# Altium project BIOWOLF.PrjPcb
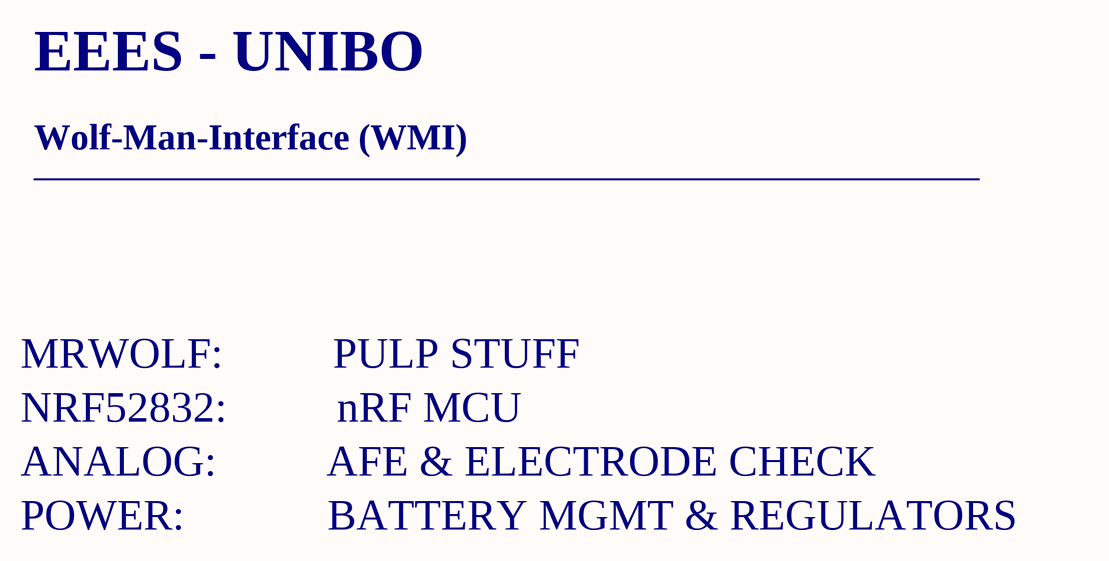
[diagram p0: 00_Cover.SchDoc]
4 sheets, 92 parts. Net scope: flat (ports and power ports of the same name join across sheets).
Board files: WOLFMAN.PcbDoc, Connectors.PcbDoc
Sheets:
  00_Cover.SchDoc
  01_MRWOLF.SchDoc
  02_NRF52832.SchDoc
  03_ANALOG.SchDoc

## Sheet 00_Cover.SchDoc
size A4

### Notes on the sheet
- EEES - UNIBO
- Wolf-Man-Interface (WMI)
- ___________________________________________
- MRWOLF:          PULP STUFF
- NRF52832:          nRF MCU
- ANALOG:          AFE & ELECTRODE CHECK
- POWER:             BATTERY MGMT & REGULATORS

## Sheet 01_MRWOLF.SchDoc: WMI (MR.WOLF)
size A4; Author: MARCO; DrawnBy: MARCO; ProjectName: WOLF-MAN-INTERFACE
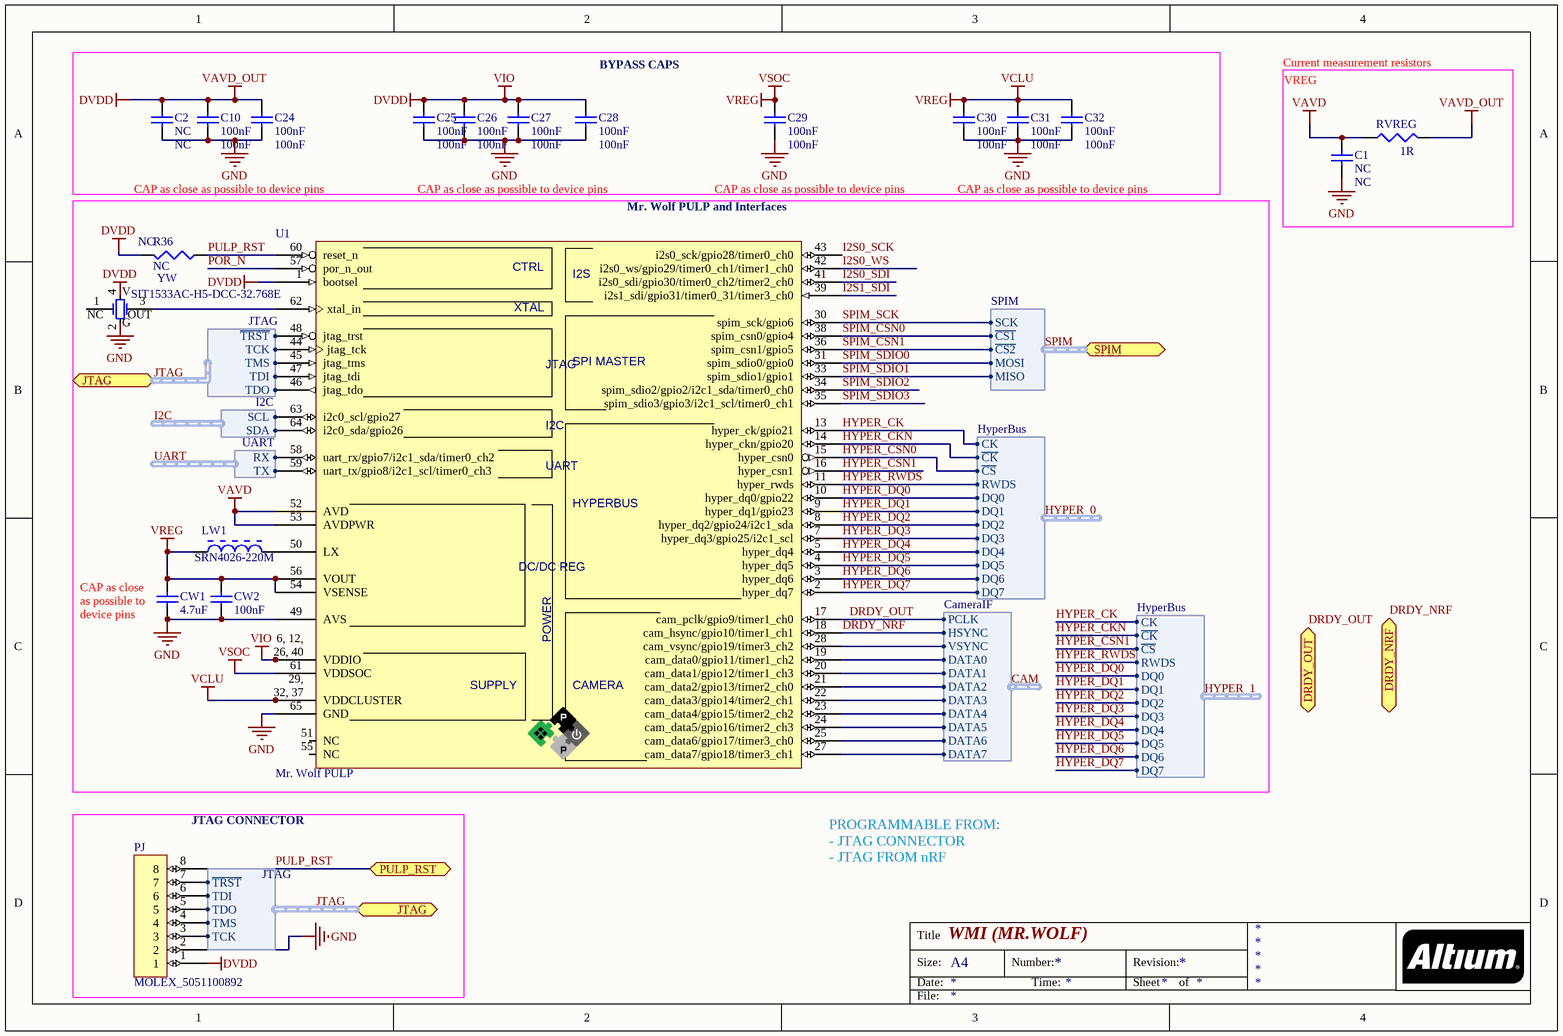
[diagram p1: 01_MRWOLF.SchDoc]

### Parts
C1  NC  [J1-0603]
C2  NC  [J1-0603]
C10  100nF  [0402]
C24  100nF  [0402]
C25  100nF  [0402]
C26  100nF  [0402]
C27  100nF  [0402]
C28  100nF  [0402]
C29  100nF  [0402]
C30  100nF  [0402]
C31  100nF  [0402]
C32  100nF  [0402]
CW1  4.7uF  [0402]
CW2  100nF  [0402]
LW1  SRN4026-220M  [1212_PCK]
PJ  MOLEX_5051100892  [MOLEX_5051100892]
R36  NC  [0402]
RVREG  value 1R  [J1-0603]
U1  Mr. Wolf PULP  [QFN50P900X900X100_HS_NOVIAS_65M]
YW  SIT1533AC-H5-DCC-32.768E  [SiT1533-C]

### Blocks framed on the sheet
BYPASS CAPS: C2 C10 C24-C32
Mr. Wolf PULP and Interfaces: CW1 CW2 LW1 R36 U1 YW
JTAG CONNECTOR: PJ

### Ports
DRDY_NRF (bidir), DRDY_OUT (bidir), JTAG (harness JTAG), PULP_RST (bidir), SPIM (harness SPIM)

### Harnesses
JTAG: ~{TRST}, TCK, TMS, TDI, TDO
HyperBus: CK, ~{CK}, ~{CS}, RWDS, DQ0, DQ1, DQ2, DQ3, DQ4, DQ5, DQ6, DQ7
I2C: SCL, SDA
UART: RX, TX
SPIM: SCK, ~{CS1}, ~{CS2}, MOSI, MISO
CameraIF: PCLK, HSYNC, VSYNC, DATA0, DATA1, DATA2, DATA3, DATA4, DATA5, DATA6, DATA7

### Nets
DVDD: C2.2 C10.2 C24.2 C25.2 C26.2 C27.2 C28.2 PJ.1 R36.2 RVREG.2 U1.1(bootsel) U1.6(VDDIO) U1.12(VDDIO) U1.26(VDDIO) U1.40(VDDIO) YW.4(VDD)  [also labelled VAVD_OUT, VIO]
GND: C1.1 C2.1 C10.1 C24.1 C25.1 C26.1 C27.1 C28.1 C29.1 C30.1 C31.1 C32.1 CW1.1 CW2.1 PJ.2 U1.49(AVS) U1.65(GND) YW.2(GND)  [project net DGND]
VAVD: C1.2 RVREG.1 U1.52(AVD) U1.53(AVDPWR)
VCLU: C29.2 C30.2 C31.2 C32.2 CW1.2 CW2.2 LW1.1 U1.29(VDDCLUSTER) U1.32(VDDCLUSTER) U1.37(VDDCLUSTER) U1.54(VSENSE) U1.56(VOUT) U1.61(VDDSOC)  [also labelled VREG, VSOC]
CAM.DATA0: U1.19(cam_data0/gpio11/timer1_ch2) ; harness CameraIF.DATA0
CAM.DATA1: U1.20(cam_data1/gpio12/timer1_ch3) ; harness CameraIF.DATA1
CAM.DATA2: U1.21(cam_data2/gpio13/timer2_ch0) ; harness CameraIF.DATA2
CAM.DATA3: U1.22(cam_data3/gpio14/timer2_ch1) ; harness CameraIF.DATA3
CAM.DATA4: U1.23(cam_data4/gpio15/timer2_ch2) ; harness CameraIF.DATA4
CAM.DATA5: U1.24(cam_data5/gpio16/timer2_ch3) ; harness CameraIF.DATA5
CAM.DATA6: U1.25(cam_data6/gpio17/timer3_ch0) ; harness CameraIF.DATA6
CAM.DATA7: U1.27(cam_data7/gpio18/timer3_ch1) ; harness CameraIF.DATA7
CAM.VSYNC: U1.28(cam_vsync/gpio19/timer3_ch2) ; harness CameraIF.VSYNC
DRDY_NRF: U1.18(cam_hsync/gpio10/timer1_ch1) ; port DRDY_NRF, harness CameraIF.HSYNC  [project net CAM.HSYNC]
DRDY_OUT: U1.17(cam_pclk/gpio9/timer1_ch0) ; port DRDY_OUT, harness CameraIF.PCLK  [project net CAM.PCLK]
HYPER_CK: U1.13(hyper_ck/gpio21) ; harness HyperBus.CK  [project net HYPER_0.CK]
HYPER_CKN: U1.14(hyper_ckn/gpio20) ; harness HyperBus.~{CK}  [project net HYPER_0.~{CK}]
HYPER_CSN0: U1.15(hyper_csn0) ; harness HyperBus.~{CS}  [project net HYPER_0.~{CS}]
HYPER_CSN1: U1.16(hyper_csn1) ; harness HyperBus.~{CS}  [project net HYPER_1.~{CS}]
HYPER_DQ0: U1.10(hyper_dq0/gpio22) ; harness HyperBus.DQ0  [project net HYPER_0.DQ0]
HYPER_DQ1: U1.9(hyper_dq1/gpio23) ; harness HyperBus.DQ1  [project net HYPER_0.DQ1]
HYPER_DQ2: U1.8(hyper_dq2/gpio24/i2c1_sda) ; harness HyperBus.DQ2  [project net HYPER_0.DQ2]
HYPER_DQ3: U1.7(hyper_dq3/gpio25/i2c1_scl) ; harness HyperBus.DQ3  [project net HYPER_0.DQ3]
HYPER_DQ4: U1.5(hyper_dq4) ; harness HyperBus.DQ4  [project net HYPER_0.DQ4]
HYPER_DQ5: U1.4(hyper_dq5) ; harness HyperBus.DQ5  [project net HYPER_0.DQ5]
HYPER_DQ6: U1.3(hyper_dq6) ; harness HyperBus.DQ6  [project net HYPER_0.DQ6]
HYPER_DQ7: U1.2(hyper_dq7) ; harness HyperBus.DQ7  [project net HYPER_0.DQ7]
HYPER_RWDS: U1.11(hyper_rwds) ; harness HyperBus.RWDS  [project net HYPER_0.RWDS]
I2C.SCL: U1.63(i2c0_scl/gpio27) ; harness I2C.SCL
I2C.SDA: U1.64(i2c0_sda/gpio26) ; harness I2C.SDA
I2S0_SCK: U1.43(i2s0_sck/gpio28/timer0_ch0)
I2S0_SDI: U1.41(i2s0_sdi/gpio30/timer0_ch2/timer2_ch0)
I2S0_WS: U1.42(i2s0_ws/gpio29/timer0_ch1/timer1_ch0)
I2S1_SDI: U1.39(i2s1_sdi/gpio31/timer0_31/timer3_ch0)
JTAG.~{TRST}: PJ.7 U1.48(jtag_trst) ; port JTAG.~{TRST}
JTAG.TCK: PJ.3 U1.44(jtag_tck) ; port JTAG.TCK
JTAG.TDI: PJ.6 U1.47(jtag_tdi) ; port JTAG.TDI
JTAG.TDO: PJ.5 U1.46(jtag_tdo) ; port JTAG.TDO
JTAG.TMS: PJ.4 U1.45(jtag_tms) ; port JTAG.TMS
POR_N: U1.57(por_n_out)
PULP_RST: PJ.8 R36.1 U1.60(reset_n) ; port PULP_RST  [project net P0.29/AIN5]
SPIM_CSN0: U1.38(spim_csn0/gpio4) ; port SPIM.~{CS1}  [project net CS#]
SPIM_CSN1: U1.36(spim_csn1/gpio5) ; port SPIM.~{CS2}  [project net CS_nRF#]
SPIM_SCK: U1.30(spim_sck/gpio6) ; port SPIM.SCK  [project net SCK]
SPIM_SDIO0: U1.31(spim_sdio0/gpio0) ; port SPIM.MOSI  [project net MOSI]
SPIM_SDIO1: U1.33(spim_sdio1/gpio1) ; port SPIM.MISO  [project net MISO]
SPIM_SDIO2: U1.34(spim_sdio2/gpio2/i2c1_sda/timer0_ch0)
SPIM_SDIO3: U1.35(spim_sdio3/gpio3/i2c1_scl/timer0_ch1)
UART.RX: U1.58(uart_rx/gpio7/i2c1_sda/timer0_ch2) ; harness UART.RX
UART.TX: U1.59(uart_tx/gpio8/i2c1_scl/timer0_ch3) ; harness UART.TX
NetLW1_2: LW1.2 U1.50(LX)
NetU1_62: U1.62(xtal_in) YW.3(OUT)

Not connected (* = marked no-connect by the designer): U1 51(NC) 55(NC); YW 1(NC)

### Buses and harness runs
harness JTAG = port JTAG
harness SPIM = port SPIM

### Notes on the sheet
- Current measurement resistors
- VREG
- CAP as close as possible to device pins
- (near CW1) CAP as close as possible to device pins
- PROGRAMMABLE FROM:
  - JTAG CONNECTOR
  - JTAG FROM nRF
- Title
- Size:
- Date:
- A4
- Number:
- Time:
- Revision:
- Sheet
- of
- File:
- (in symbol PULP_MR_WOLF) CTRL; I2S; XTAL; JTAG; SPI MASTER; I2C; UART; HYPERBUS; DC/DC REG; POWER; 6, 12,; 26, 40; 29,; SUPPLY; CAMERA; 32, 37
- (in symbol SIT-OSC32KHZ-SIT1533AC-H5-DCC-32.768) V; G

### Library data of the parts
C1 C2 C10 C24-C32 = Cap Semi: Capacitor (Semiconductor SIM Model); Published: 8-Jun-2000; LatestRevisionDate: 29-May-2009; LatestRevisionNote: IPC-7351 Footprint Added.; PackageReference: C1206; Publisher: Altium Limited; PackageDescription: Chip Capacitor
  C1 C2: Value: NC
  C10 C24-C32: Value: 100nF
CW1 CW2 = Cap Semi: Capacitor (Semiconductor SIM Model); Value: 100pF; Published: 8-Jun-2000; LatestRevisionDate: 29-May-2009; LatestRevisionNote: IPC-7351 Footprint Added.; PackageReference: C1206; Publisher: Altium Limited; PackageDescription: Chip Capacitor
LW1 = BOUR-IND-SRN4026-220M: Semi-shielded Power Inductor, 22uH, 3A; Manufacturer: Bourns; Core Material: Ferrite; Tolerance: 20%; Current Rating: 670mA; DC Resistance (DCR): 234mR; Self Resonant Frequency: 16MHz; Test Frequency: 100kHz; ComponentLink1URL: https://www.bourns.com/docs/Product-Datasheets/SRN4026.pdf; ComponentLink1Description: Datasheet; Supplier 1: RSComponents; Supplier Part Number 1: 813-5643P; Manufacturer Part Number: SRN4026-220M; Stock 1: 2770; Pricing 1: 100=0.209, 500=0.176, 3000=0.135, 6000=0.132 (EUR); Mount: Surface Mount; Case/Package: Nonstandard; Weight: 0.004938oz; Min Operating Temperature: -40°C; Max Operating Temperature: 125°C; Packaging: Tape and Reel; Composition: Wirewound; Inductance: 22uh; Saturation Current: 670mA; Shielding: Shielded; Max DC Current: 670mA; Termination: SMD/SMT; RMS Current (Irms): 670mA; Inductance Tolerance: 20%; Package Quantity: 3000; Length: 4mm; Height: 2.5mm; Width: 4mm; Height - Seated (Max): 0.098inch; Depth: 4mm; REACH SVHC: No SVHC; ComponentLink2URL: https://datasheet.ciiva.com/48684/srn4026-48684665.pdf; ComponentLink2Description: https://datasheet.ciiva.com/48684/srn4026-48684665.pdf; ComponentLink3URL: https://datasheet.ciiva.com/46641/70371276-46641103.pdf; ComponentLink3Description: https://datasheet.ciiva.com/46641/70371276-46641103.pdf; Supplier 2: Farnell; Supplier Part Number 2: 2428221; Stock 2: 402; Pricing 2: 5=0.298, 50=0.217, 250=0.175, 500=0.16, 1500=0.155, 3000=0.151, 15000=0.146 (EUR); Supplier 3: Digi-Key; Supplier Part Number 3: SRN4026-220MTR-ND; Stock 3: 0; Pricing 3: 3000=0.144, 6000=0.1395, 15000=0.135, 30000=0.133 (USD); Supplier 4: Digi-Key; Supplier Part Number 4: SRN4026-220MDKR-ND; Stock 4: 863; Pricing 4: 1=0.41, 10=0.362, 100=0.2588, 500=0.2174, 1000=0.176 (USD); Supplier 5: Mouser; Supplier Part Number 5: 652-SRN4026-220M; Stock 5: 140; Pricing 5: 1=0.36, 10=0.246, 50=0.246, 100=0.224, 1000=0.152, 10000=0.122 (USD); Supplier 6: Digi-Key; Supplier Part Number 6: SRN4026-220MCT-ND; Stock 6: 863; Pricing 6: 1=0.41, 10=0.362, 100=0.2588, 500=0.2174, 1000=0.176 (USD); Supplier 7: RSComponents; Supplier Part Number 7: 8135643; Stock 7: 1990; Pricing 7: 10=0.227, 100=0.216, 500=0.19, 3000=0.13, 6000=0.12 (GBP); Supplier 8: Distrelec; Supplier Part Number 8: SRN4026-220M; Stock 8: 3000; Pricing 8: 1=0.6667, 10=0.5, 100=0.3333, 500=0.2857 (EUR); Supplier 9: Farnell; Supplier Part Number 9: 2428221RL; Stock 9: 930; Pricing 9: 50=0.209, 250=0.165, 500=0.15, 1500=0.122, 3000=0.117, 15000=0.106, 30000=0.104 (GBP); Supplier 10: Distrelec; Supplier Part Number 10: 30026188; Stock 10: 2895; Pricing 10: 1=0.214, 10=0.1299, 50=0.1266, 250=0.1203, 500=0.1173, 2500=0.1145 (EUR); Supplier 11: RSComponents; Supplier Part Number 11: 813-5643; Stock 11: 2000; Pricing 11: 10=0.227, 100=0.216 (GBP)
R36 RVREG = Res3: Resistor; Published: 8-Jun-2000; LatestRevisionDate: 29-May-2009; LatestRevisionNote: IPC-7351 Footprint Added.; PackageReference: J1-0603; Publisher: Altium Limited; PackageDescription: Chip Resistor
  R36: Value: NC
U1 = PULP_MR_WOLF: Mr. Wolf PULP Heterogeneous Multi-Core System-On-Chip; Manufacturer: Aries Alectronics Inc.; Manufacturer Part Num: 23017; Part Class: Connectors; .checked_Footprint: 140604-11/scd; Num Pins: 64 (+9)
YW = SIT-OSC32KHZ-SIT1533AC-H5-DCC-32.768: 20 ppm, Ultra-Low Power 32.768 kHz Quartz XTAL Replacement; Current - Supply (max): 1.3uA; ComponentLink1URL: http://www.sitime.com/products/datasheets/sit1533/SiT1533-datasheet.pdf; ComponentLink1Description: Datasheet; Frequency: 32.768kHz; Supplier 1: Digi-Key; Supplier Part Number 1: 1473-1515-2-ND; Supplier 2: Digi-Key; Supplier Part Number 2: 1473-1515-1-ND; Supplier 3: Digi-Key; Supplier Part Number 3: 1473-1515-6-ND; Supplier 4: Digi-Key; Supplier Part Number 4: 1473-1516-2-ND; Supplier 5: Digi-Key; Supplier Part Number 5: 1473-1516-1-ND; Supplier 6: Digi-Key; Supplier Part Number 6: 1473-1516-6-ND; Supplier 7: Digi-Key; Supplier Part Number 7: SIT1533AC-H5-DCC-32.768S-ND; Supplier 8: Digi-Key; Supplier Part Number 8: SIT1533AC-H5-DCC-32.768D-ND

## Sheet 02_NRF52832.SchDoc: WMI (BLE)
size A4
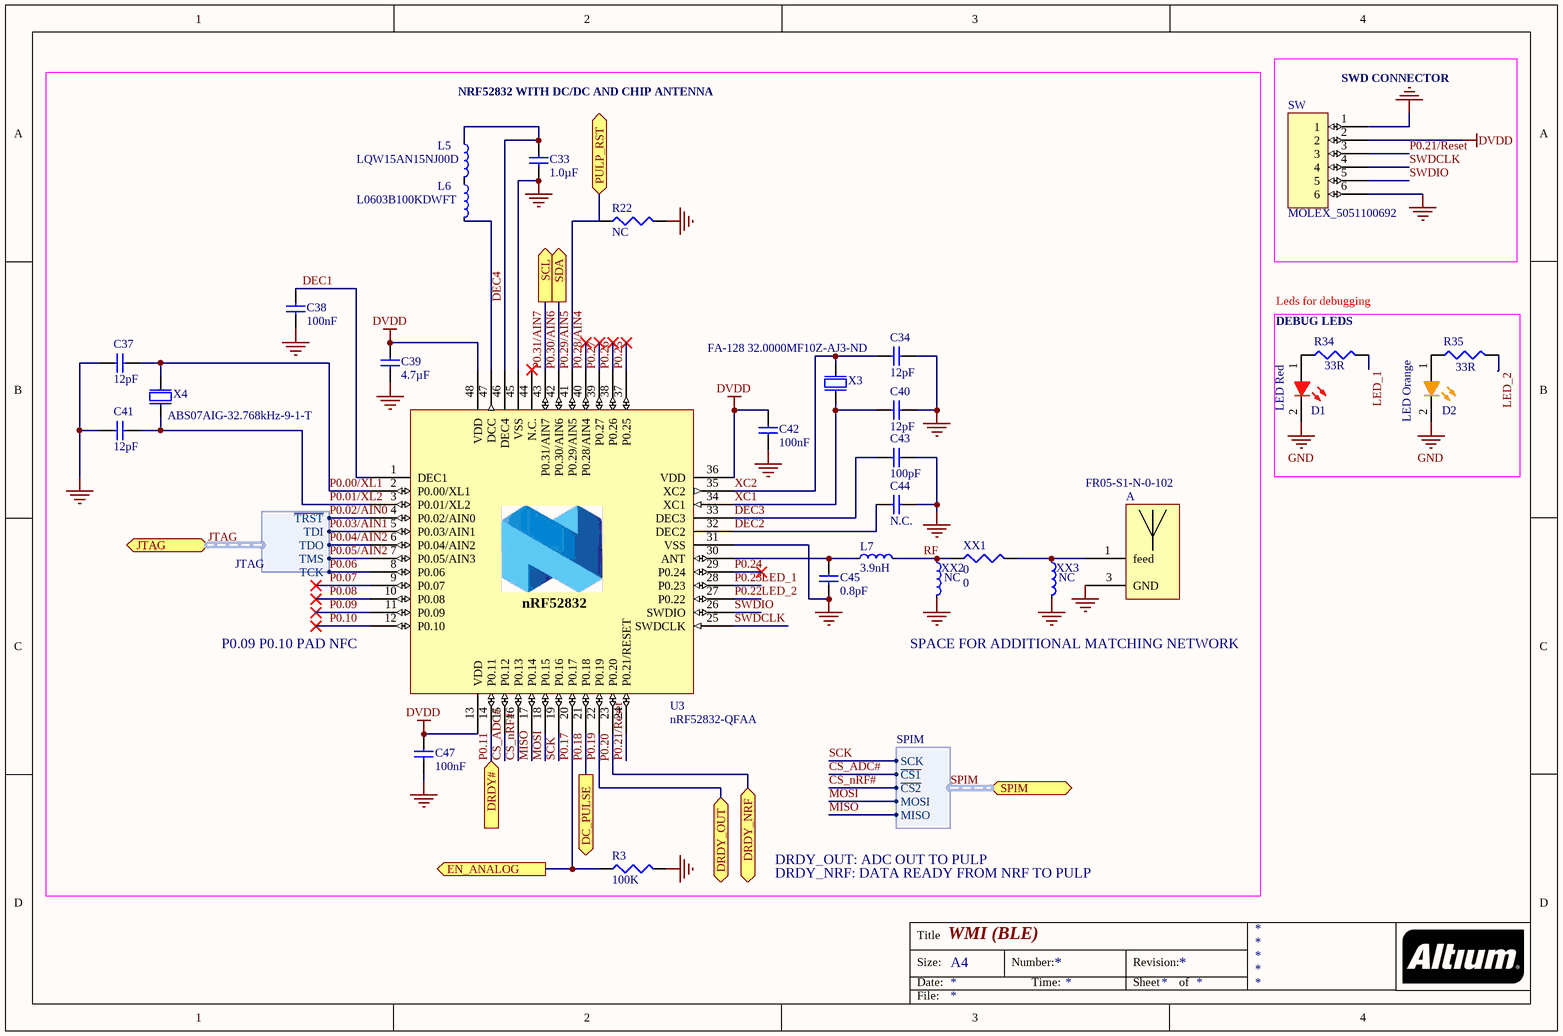
[diagram p2: 02_NRF52832.SchDoc]

### Parts
A  FR05-S1-N-0-102  [DFN510P700X220-2N]
C33  1.0µF  [CAPC1608X06L]
C34  12pF  [CAPC1005X04L]
C37  12pF  [CAPC1005X04L]
C38  100nF  [CAPC1005X04L]
C39  4.7µF  [CAPC1608X06L]
C40  12pF  [CAPC1005X04L]
C41  12pF  [CAPC1005X04L]
C42  100nF  [CAPC1005X04L]
C43  100pF  [CAPC1005X04L]
C44  N.C.  [CAPC1005X04L]
C45  0.8pF  [CAPC1005X04L]
C47  100nF  [CAPC1005X04L]
D1  LED Red  [DIOC1608X08L]
D2  LED Orange  [DIOC1608X08L]
L5  LQW15AN15NJ00D  [INDC1005X04L]
L6  L0603B100KDWFT  [J1-0603]
L7  3.9nH  [INDC1005X04L]
R3  100K  [0402]
R22  NC  [0402]  (graphical)
R34  value 33R  [J1-0603]
R35  value 33R  [J1-0603]
SW  MOLEX_5051100692  [MOLEX_5051100692]
U3  nRF52832-QFAA  [QFN40P600X600X90-48N]
X3  FA-128 32.0000MF10Z-AJ3-ND  [BT-XTAL_2016]
X4  ABS07AIG-32.768kHz-9-1-T  [XTAL_3215]
XX1  0  [0402]
XX2  NC  [INDC1005X04L]
XX3  NC  [INDC1005X04L]

### Blocks framed on the sheet
SWD CONNECTOR: SW
DEBUG LEDS: D1 D2 R34 R35

### Ports
DC_PULSE (out), DRDY# (in), DRDY_NRF (bidir), DRDY_OUT (bidir), EN_ANALOG (out), JTAG (harness JTAG), PULP_RST (bidir), SCL (out), SDA (out), SPIM (harness SPIM)

### Harnesses
SPIM: SCK, ~{CS1}, ~{CS2}, MOSI, MISO
JTAG: ~{TRST}, TCK, TMS, TDI, TDO

### Nets
DVDD: C39.1 C42.1 C47.1 SW.2 U3.13(VDD) U3.36(VDD) U3.48(VDD)
GND: A.3(GND) C33.1 C34.2 C37.2 C38.2 C39.2 C40.2 C41.2 C42.2 C43.2 C44.1 C45.1 C47.2 D1.2(K) D2.2(K) R3.2 R22.2 SW.1 SW.6 U3.31(VSS) U3.45(VSS) U3.49(GND) X3.2(GND) X3.4(GND) XX2.2 XX3.2  [project net DGND]
CS_ADC#: U3.15(P0.12) ; port SPIM.~{CS1}  [project net CS#]
CS_nRF#: U3.16(P0.13) ; port SPIM.~{CS2}
DEC1: C38.1 U3.1(DEC1)
DEC2: C44.2 U3.32(DEC2)
DEC3: C43.1 U3.33(DEC3)
DEC4: C33.2 L5.1 U3.46(DEC4)
LED_1: R34.2 U3.28(P0.23)  [also labelled P0.23]
LED_2: R35.2 U3.27(P0.22)  [also labelled P0.22]
MISO: U3.17(P0.14) ; port SPIM.MISO
MOSI: U3.18(P0.15) ; port SPIM.MOSI
P0.00/XL1: C37.1 U3.2(P0.00/XL1) X4.1(inp)
P0.01/XL2: C41.1 U3.3(P0.01/XL2) X4.2(out)
P0.02/AIN0: U3.4(P0.02/AIN0) ; port JTAG.~{TRST}  [project net JTAG.~{TRST}]
P0.03/AIN1: U3.5(P0.03/AIN1) ; port JTAG.TDI  [project net JTAG.TDI]
P0.04/AIN2: U3.6(P0.04/AIN2) ; port JTAG.TDO  [project net JTAG.TDO]
P0.05/AIN2: U3.7(P0.05/AIN3) ; port JTAG.TMS  [project net JTAG.TMS]
P0.06: U3.8(P0.06) ; port JTAG.TCK  [project net JTAG.TCK]
P0.07: U3.9(P0.07)
P0.08: U3.10(P0.08)
P0.09: U3.11(P0.09)
P0.10: U3.12(P0.10)
P0.11: U3.14(P0.11) ; port DRDY#
P0.17: R3.1 U3.20(P0.17) ; port EN_ANALOG
P0.18: U3.21(P0.18) ; port DC_PULSE
P0.19: U3.22(P0.19) ; port DRDY_OUT  [project net CAM.PCLK]
P0.20: U3.23(P0.20) ; port DRDY_NRF  [project net CAM.HSYNC]
P0.21/Reset: SW.3 U3.24(P0.21/RESET)
P0.24: U3.29(P0.24)
P0.25: U3.37(P0.25)
P0.26: U3.38(P0.26)
P0.27: U3.39(P0.27)
P0.28/AIN4: U3.40(P0.28/AIN4)
P0.29/AIN5: R22.1 U3.41(P0.29/AIN5) ; port PULP_RST
P0.30/AIN6: U3.42(P0.30/AIN6) ; port SDA
P0.31/AIN7: U3.43(P0.31/AIN7) ; port SCL
RF: L7.2 XX1.1 XX2.1
SCK: U3.19(P0.16) ; port SPIM.SCK
SWDCLK: SW.4 U3.25(SWDCLK)
SWDIO: SW.5 U3.26(SWDIO)
XC1: C40.1 U3.34(XC1) X3.1(inp)
XC2: C34.1 U3.35(XC2) X3.3(out)
NetA_1: A.1(feed) XX1.2 XX3.1
NetC45_2: C45.2 L7.1 U3.30(ANT)
NetD1_1: D1.1(A) R34.1
NetD2_1: D2.1(A) R35.1
NetL5_2: L5.2 L6.1
NetL6_2: L6.2 U3.47(DCC)

Not connected (* = marked no-connect by the designer): A 2(not_connected); U3 44(N.C.)*

### Buses and harness runs
harness JTAG = port JTAG
harness SPIM = port SPIM

### Notes on the sheet
- NRF52832 WITH DC/DC AND CHIP ANTENNA
- Leds for debugging
- (near U3) P0.09 P0.10 PAD NFC
- SPACE FOR ADDITIONAL MATCHING NETWORK
- DRDY_OUT: ADC OUT TO PULP
- DRDY_NRF: DATA READY FROM NRF TO PULP
- Title
- Size:
- Date:
- A4
- Number:
- Time:
- Revision:
- Sheet
- of
- File:
- (in symbol nRF52832-QFAB) nRF52832

### Library data of the parts
A = FR05-S1-N-0-102: Bluetooth antenna
C33 = C0603-1µ0: Capacitor, X7R, ±10%; Note: 16V; Artikkelnr Noca: 20039335; Artikkelnr Simpro: N.A.; Part Number: C0603-1µ0; Manufacturer: *; Manufacturer Part Number: *; Datasheet: *; LatestRevisionDate: 2013-06-05; Pin Count: 2; Publisher: Nordic Semiconductor; Published: 2009-05-08; Value: 1.0µF; Supplier: *; Supplier part number: *; 2nd source Supplier: *; 2nd source part number: *; Footprint Doc: 0603
C34 C37 C40 C41 = C0402-12p: Capacitor, NP0, ±2%; Note: 50V; Artikkelnr Noca: 20029159; Artikkelnr Simpro: N.A.; Part Number: C0402-12p; Manufacturer: *; Manufacturer Part Number: *; Datasheet: *; LatestRevisionDate: 2011-05-11; Pin Count: 2; Publisher: Nordic Semiconductor; Published: 2009-05-08; Value: 12pF; Supplier: *; Supplier part number: *; 2nd source Supplier: *; 2nd source part number: *; Footprint Doc: 0402
C38 C42 C47 = C0402-100n: Capacitor, X7R, ±10%; Note: 16V; Artikkelnr Noca: 20039200; Artikkelnr Simpro: N.A.; Part Number: C0402-100n; Manufacturer: *; Manufacturer Part Number: *; Datasheet: *; LatestRevisionDate: 2009-11-23; Pin Count: 2; Publisher: Nordic Semiconductor; Published: 2009-05-08; Value: 100nF; Supplier: *; Supplier part number: *; 2nd source Supplier: *; 2nd source part number: *; Footprint Doc: 0402
C39 = C0603-4µ7: Capacitor, X5R, ±10%; Note: 6.3V; Artikkelnr Noca: 20069060; Artikkelnr Simpro: N.A.; Part Number: C0603-4µ7; Manufacturer: *; Manufacturer Part Number: *; Datasheet: *; LatestRevisionDate: 2009-11-23; Pin Count: 2; Publisher: Nordic Semiconductor; Published: 2009-05-08; Value: 4.7µF; Supplier: *; Supplier part number: *; 2nd source Supplier: *; 2nd source part number: *; Footprint Doc: 0603
C43 = C0402-100p: Capacitor, NP0, ±5%; Note: 50V; Artikkelnr Noca: 20029135; Artikkelnr Simpro: N.A.; Part Number: C0402-100p; Manufacturer: *; Manufacturer Part Number: *; Datasheet: *; LatestRevisionDate: 2009-05-08; Pin Count: 2; Publisher: Nordic Semiconductor; Published: 2009-05-08; Value: 100pF; Supplier: *; Supplier part number: *; 2nd source Supplier: *; 2nd source part number: *; Footprint Doc: 0402
C44 = C0402-N.C.: Not mounted; Note: Chip Cap; Artikkelnr Noca: N.A.; Part Number: C0402-N.C.; Manufacturer: *; Manufacturer Part Number: *; Datasheet: *; LatestRevisionDate: 2009-05-08; Pin Count: 2; Publisher: Nordic Semiconductor; Published: 2009-05-08; Value: N.C.; Supplier: *; Supplier part number: *; 2nd source Supplier: *; 2nd source part number: *; Footprint Doc: 0402; Artikkelnr Simpro: N.A.
C45 = C0402-0.8p: Capacitor, NP0, ±5%; Note: 50V; Artikkelnr Noca: 20029147; Artikkelnr Simpro: N.A.; Part Number: C0402-0.8p; Manufacturer: *; Manufacturer Part Number: *; Datasheet: *; LatestRevisionDate: 2012-11-21; Pin Count: 2; Publisher: Nordic Semiconductor; Published: 2009-05-08; Value: 0.8pF; Supplier: *; Supplier part number: *; 2nd source Supplier: *; 2nd source part number: *; Footprint Doc: 0402
D1 = KING-LED-RED-APT1608LSECK/J3-PRV: 1.6X0.8mm SMD CHIP LED LAMP, Hyper Red; Part Number: APT1608LSECK/J4-PRV; Forward Voltage: 1.8V; Test Current: 2mA; ComponentLink1Description: Datasheet; ComponentLink1URL: http://www.kingbrightusa.com/images/catalog/SPEC/APT1608LSECK-J3-PRV.pdf; Supplier 1: Digi-Key; Supplier 2: Mouser; Supplier 3: Digi-Key; Supplier 4: Digi-Key; Supplier Part Number 1: 754-1930-6-ND; Supplier Part Number 2: 604-APT1608LSECKJ3RV; Supplier Part Number 3: 754-1930-1-ND; Supplier Part Number 4: 754-1930-2-ND
D2 = KING-LED-ORANGE-APT1608LSECK/J4-PRV: 1.6X0.8mm SMD CHIP LED LAMP, Super Bright Orange; Forward Voltage: 1.8V; Test Current: 2mA; Part Number: APT1608LSECK/J4-PRV; ComponentLink1Description: Datasheet; ComponentLink1URL: http://www.kingbrightusa.com/images/catalog/SPEC/APT1608LSECK-J4-PRV.pdf; Supplier 1: Digi-Key; Supplier 2: Digi-Key; Supplier 3: Mouser; Supplier 4: Digi-Key; Supplier Part Number 1: 754-1931-6-ND; Supplier Part Number 2: 754-1931-1-ND; Supplier Part Number 3: 604-APT1608LSECKJ4RV; Supplier Part Number 4: 754-1931-2-ND
L5 = L0402-15n: High frequency chip inductor ±10%; Manufacturer: Taiyo Yuden; Manufacturer Part Number: HK100515NJ-T; 2nd source part number: 658-1328; Value: 15nH; Artikkelnr Noca: 33029323; Artikkelnr Simpro: N.A.; Part Number: L0402-15n; LatestRevisionDate: 2012-09-19; Pin Count: 2; Publisher: Nordic Semiconductor; Published: 2010-07-12; Note: High frequency chip inductor ±10%; Supplier: Digi-Key; Datasheet: http://www.yuden.co.jp/productdata/catalog/en/mlci04_e.pdf; Supplier part number: 587-1521-1-ND; 2nd source Supplier: Farnell; Footprint Doc: 0402
L6 = L0603-10µ: Chip inductor, IDC,min = 50 mA, ±20%; Manufacturer: Taiyo Yuden; Manufacturer Part Number: LBMF1608T100K; 2nd source part number: 178-6105; Value: 10µH; Note: LBMF1608T100K 10µH 80mA 0603; Artikkelnr Noca: 33029314; Artikkelnr Simpro: N.A.; Part Number: L0603-10µ; Datasheet: http://www.yuden.co.jp/ut/product/pdf/elb2_e.pdf; LatestRevisionDate: 2012-09-19; Pin Count: 2; Publisher: Nordic Semiconductor; Published: 2010-02-24; Supplier: Digi-Key; Supplier part number: 587-1714-1-ND; 2nd source Supplier: Farnell; Footprint Doc: 0603
L7 = L0402-3n9: High frequency chip inductor ±5%; Manufacturer: Murata; Manufacturer Part Number: LQP15MN3N9B02D; Artikkelnr Noca: 33029151; Artikkelnr Simpro: N.A.; Part Number: L0402-3n9; Datasheet: http://search.murata.co.jp/Ceramy/image/img/PDF/ENG/L0075S0084LQP15M.pdf; LatestRevisionDate: 2012-09-19; Pin Count: 2; Publisher: Nordic Semiconductor; Published: 2009-05-08; Value: 3.9nH; Note: High frequency chip inductor ±5%; Supplier: Digi-Key; Supplier part number: 490-1131-1-ND; 2nd source Supplier: *; 2nd source part number: *; Footprint Doc: 0402
R3 R22 R34 R35 XX1 = Res3: Resistor; Published: 8-Jun-2000; LatestRevisionDate: 29-May-2009; LatestRevisionNote: IPC-7351 Footprint Added.; PackageReference: J1-0603; Publisher: Altium Limited; PackageDescription: Chip Resistor
  R3: Value: 100K
  R22: Value: NC
  XX1: Value: 0
U3 = nRF52832-QFAB: Multi-protocol Bluetooth Low Energy, ANT and 2.4GHz proprietary system-on-chip; Manufacturer: Nordic Semiconductor; Artikkelnr Noca: N.A.; Part Number: nRF52832-QFAA; Manufacturer Part Number: nRF52832-QFAA; Datasheet: *; LatestRevisionDate: 2016-11-24; Pin Count: 48; Publisher: Nordic Semiconductor; Published: 2016-11-24; Value: nRF52832-QFAA; Note: *; Supplier: Nordic Semiconductor; Supplier part number: *; 2nd source Supplier: *; 2nd source part number: *; Footprint Doc: QFN-48; Artikkelnr Simpro: N.A.
X3 = XTAL_SMD2016_32MHz_8pF_General: XTAL SMD 2016, 32MHz, Cl=8pF, Total Tol: ±40ppm; Note: XTAL SMD 32.000MHz; Artikkelnr Noca: N.A.; Part Number: XTAL_SMD2016_32MHz_8pF_General; Manufacturer: *; Manufacturer Part Number: *; Datasheet: *; LatestRevisionDate: 2016-08-19; Pin Count: 4; Publisher: Nordic Semiconductor; Published: 2016-08-19; Value: 32MHz; Supplier: *; Supplier part number: *; 2nd source Supplier: *; 2nd source part number: *; Footprint Doc: XTAL_2016; Artikkelnr Simpro: N.A.
X4 = XTAL_SMD3215_32.768kHz_9pF_General: XTAL SMD 3215, 32.768kHz, Cl=9pF, Total Tol: ±50ppm; Note: XTAL SMD 32.768kHz; Artikkelnr Noca: N.A.; Part Number: XTAL_SMD3215_32.768kHz_9pF_General; Manufacturer: *; Manufacturer Part Number: *; Datasheet: *; LatestRevisionDate: 2016-08-19; Pin Count: 2; Publisher: Nordic Semiconductor; Published: 2016-08-19; Value: 32.768kHz; Supplier: *; Supplier part number: *; 2nd source Supplier: *; 2nd source part number: *; Footprint Doc: XTAL_3215; Artikkelnr Simpro: N.A.
XX2 XX3 = L0402-N.C.: Not mounted; Value: N.C.; Artikkelnr Noca: N.A.; Assembly: Not mounted; Part Number: L0402-N.C.; Manufacturer: *; Manufacturer Part Number: *; Datasheet: *; LatestRevisionDate: 2016-11-24; Pin Count: 2; Publisher: Nordic Semiconductor; Published: 2016-11-24; Note: *; Supplier: *; Supplier part number: *; 2nd source Supplier: *; 2nd source part number: *; Footprint Doc: 0402; Artikkelnr Simpro: N.A.; ComponentLink1Description: Datasheet; ComponentLink2Description: Supplier link

## Sheet 03_ANALOG.SchDoc: WMI (AFE)
size A4
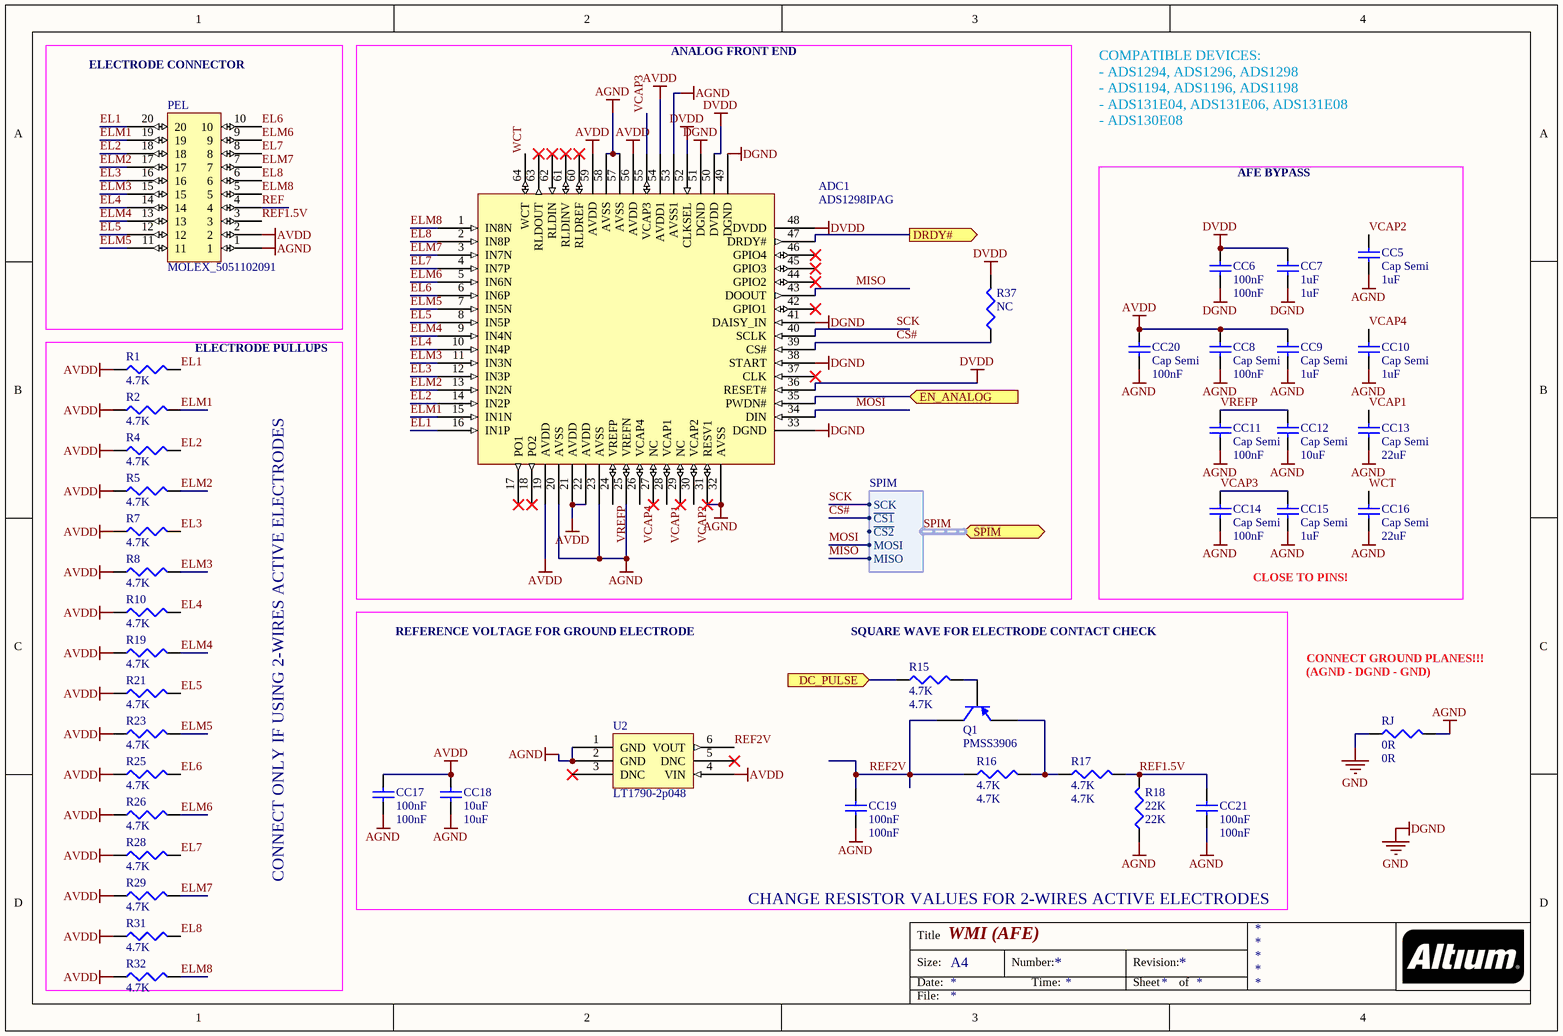
[diagram p3: 03_ANALOG.SchDoc]

### Parts
ADC1  ADS1298IPAG  [LQFP64_M]
CC5  Cap Semi  value 1uF  [0402]
CC6  100nF  [0402]
CC7  1uF  [0402]
CC8  Cap Semi  value 100nF  [0402]
CC9  Cap Semi  value 1uF  [0402]
CC10  Cap Semi  value 1uF  [0402]
CC11  Cap Semi  value 100nF  [0402]
CC12  Cap Semi  value 10uF  [0402]
CC13  Cap Semi  value 22uF  [J1-0603]
CC14  Cap Semi  value 100nF  [0402]
CC15  Cap Semi  value 1uF  [0402]
CC16  Cap Semi  value 22uF  [1608[0603]]
CC17  100nF  [0402]
CC18  10uF  [0402]
CC19  100nF  [0402]
CC20  Cap Semi  value 100nF  [0402]
CC21  100nF  [0402]
PEL  MOLEX_5051102091  [MOLEX_5051102091]
Q1  PMSS3906  [SOT323_N]
R1  4.7K  [0402]
R2  4.7K  [0402]
R4  4.7K  [0402]
R5  4.7K  [0402]
R7  4.7K  [0402]
R8  4.7K  [0402]
R10  4.7K  [0402]
R15  4.7K  [0402]
R16  4.7K  [0402]
R17  4.7K  [0402]
R18  22K  [0402]
R19  4.7K  [0402]
R21  4.7K  [0402]
R23  4.7K  [0402]
R25  4.7K  [0402]
R26  4.7K  [0402]
R28  4.7K  [0402]
R29  4.7K  [0402]
R31  4.7K  [0402]
R32  4.7K  [0402]
R37  NC  [0402]
RJ  0R  [0402]
U2  LT1790-2p048  [SOT-23_A_N]

### Blocks framed on the sheet
ELECTRODE CONNECTOR: PEL
ANALOG FRONT END: ADC1 R37
CONNECT ONLY IF USING 2-WIRES ACTIVE ELECTRODES: R1 R2 R4 R5 R7 R8 R10 R19 R21 R23 R25 R26 R28 R29 R31 R32
CHANGE RESISTOR VALUES FOR 2-WIRES ACTIVE ELECTRODES: CC17-CC19 CC21 Q1 R15-R18 U2

### Ports
DC_PULSE (in), DRDY# (out), EN_ANALOG (in), SPIM (harness SPIM)

### Harnesses
SPIM: SCK, ~{CS1}, ~{CS2}, MOSI, MISO

### Nets
AGND: ADC1.20(AVSS) ADC1.23(AVSS) ADC1.25(VREFN) ADC1.31(RESV1) ADC1.32(AVSS) ADC1.53(AVSS1) ADC1.57(AVSS) ADC1.58(AVSS) CC5.1 CC8.1 CC9.1 CC10.1 CC11.1 CC12.1 CC13.1 CC14.1 CC15.1 CC16.1 CC17.1 CC18.1 CC19.1 CC20.1 CC21.1 PEL.1 R18.1 RJ.2 U2.1(GND) U2.2(GND)
AVDD: ADC1.19(AVDD) ADC1.21(AVDD) ADC1.22(AVDD) ADC1.54(AVDD1) ADC1.56(AVDD) ADC1.59(AVDD) CC8.2 CC9.2 CC17.2 CC18.2 CC20.2 PEL.2 R1.1 R2.1 R4.1 R5.1 R7.1 R8.1 R10.1 R19.1 R21.1 R23.1 R25.1 R26.1 R28.1 R29.1 R31.1 R32.1 U2.4(VIN)
DGND: ADC1.33(DGND) ADC1.38(START) ADC1.41(DAISY_IN) ADC1.49(DGND) ADC1.51(DGND) CC6.1 CC7.1 RJ.1  [also labelled GND]
DVDD: ADC1.36(RESET#) ADC1.48(DVDD) ADC1.50(DVDD) ADC1.52(CLKSEL) CC6.2 CC7.2 R37.2
CS#: ADC1.39(CS#) R37.1 ; port SPIM.~{CS1}
EL1: ADC1.16(IN1P) PEL.20 R1.2
EL2: ADC1.14(IN2P) PEL.18 R4.2
EL3: ADC1.12(IN3P) PEL.16 R7.2
EL4: ADC1.10(IN4P) PEL.14 R10.2
EL5: ADC1.8(IN5P) PEL.12 R21.2
EL6: ADC1.6(IN6P) PEL.10 R25.2
EL7: ADC1.4(IN7P) PEL.8 R28.2
EL8: ADC1.2(IN8P) PEL.6 R31.2
ELM1: ADC1.15(IN1N) PEL.19 R2.2
ELM2: ADC1.13(IN2N) PEL.17 R5.2
ELM3: ADC1.11(IN3N) PEL.15 R8.2
ELM4: ADC1.9(IN4N) PEL.13 R19.2
ELM5: ADC1.7(IN5N) PEL.11 R23.2
ELM6: ADC1.5(IN6N) PEL.9 R26.2
ELM7: ADC1.3(IN7N) PEL.7 R29.2
ELM8: ADC1.1(IN8N) PEL.5 R32.2
MISO: ADC1.43(DOOUT) ; port SPIM.MISO
MOSI: ADC1.34(DIN) ; port SPIM.MOSI
P0.11: ADC1.47(DRDY#) ; port DRDY#
P0.17: ADC1.35(PWDN#) ; port EN_ANALOG
P0.18: R15.1 ; port DC_PULSE
REF: PEL.4
REF1.5V: CC21.2 PEL.3 R17.2 R18.2
REF2V: CC19.2 Q1.3(C) R16.1 U2.6(VOUT)
SCK: ADC1.40(SCLK) ; port SPIM.SCK
VCAP1: ADC1.28(VCAP1) CC13.2
VCAP2: ADC1.30(VCAP2) CC5.2
VCAP3: ADC1.55(VCAP3) CC14.2 CC15.2
VCAP4: ADC1.26(VCAP4) CC10.2
VREFP: ADC1.24(VREFP) CC11.2 CC12.2
WCT: ADC1.64(WCT) CC16.2
NetQ1_1: Q1.1(B) R15.2
NetQ1_2: Q1.2(E) R16.2 R17.1

Not connected (* = marked no-connect by the designer): ADC1 17(PO1)* 18(PO2)* 27(NC)* 29(NC)* 37(CLK)* 42(GPIO1)* 44(GPIO2)* 45(GPIO3)* 46(GPIO4)* 60(RLDREF)* 61(RLDINV)* 62(RLDIN)* 63(RLDOUT)*; U2 3(DNC)* 5(DNC)*

### Buses and harness runs
harness SPIM = port SPIM

### Notes on the sheet
- COMPATIBLE DEVICES:
  - ADS1294, ADS1296, ADS1298
  - ADS1194, ADS1196, ADS1198
  - ADS131E04, ADS131E06, ADS131E08
  - ADS130E08
- AFE BYPASS
- ELECTRODE PULLUPS
- CLOSE TO PINS!
- REFERENCE VOLTAGE FOR GROUND ELECTRODE
- (near R15) SQUARE WAVE FOR ELECTRODE CONTACT CHECK
- (AGND - DGND - GND)
- CONNECT GROUND PLANES!!!
- Title
- Size:
- Date:
- A4
- Number:
- Time:
- Revision:
- Sheet
- of
- File:

### Library data of the parts
ADC1 = ADS1298
CC5-CC21 = Cap Semi: Capacitor (Semiconductor SIM Model); Published: 8-Jun-2000; LatestRevisionDate: 29-May-2009; LatestRevisionNote: IPC-7351 Footprint Added.; PackageReference: C1206; Publisher: Altium Limited; PackageDescription: Chip Capacitor
  CC6 CC17 CC19 CC21: Value: 100nF
  CC7: Value: 1uF
  CC18: Value: 10uF
Q1 = PMSS3906: PNP Switching Transistor; Published: 17-Sep-2003; LatestRevisionDate: 12-Dec-2006; LatestRevisionNote: IPC-7351 Footprint Added.; DatasheetVersion: 22-Apr-1999; PackageVersion: Apr-1999; PackageReference: SOT323; Publisher: Altium Limited; PackageDescription: 3-Pin SOT-323 Package 0.65 mm Pitch, 2.1 mm Lead Span; ComponentLink1Description: Manufacturer Link; ComponentLink1URL: http://www.semiconductors.philips.com/; ComponentLink2Description: Datasheet; ComponentLink2URL: http://www.semiconductors.philips.com/acrobat/datasheets/PMSS3906_4.pdf
R1 R2 R4 R5 R7 R8 R10 R15-R19 R21 R23 R25 R26 R28 R29 R31 R32 R37 RJ = Res3: Resistor; Published: 8-Jun-2000; LatestRevisionDate: 29-May-2009; LatestRevisionNote: IPC-7351 Footprint Added.; PackageReference: J1-0603; Publisher: Altium Limited; PackageDescription: Chip Resistor
  R1 R2 R4 R5 R7 R8 R10 R15-R17 R19 R21 R23 R25 R26 R28 R29 R31 R32: Value: 4.7K
  R18: Value: 22K
  R37: Value: NC
  RJ: Value: 0R
U2 = LT1790

## Nets that join several sheets
DGND: 01_MRWOLF (18 pins), 02_NRF52832 (26 pins), 03_ANALOG (8 pins)
DVDD: 01_MRWOLF (16 pins), 02_NRF52832 (7 pins), 03_ANALOG (7 pins)
CAM.HSYNC: 01_MRWOLF (U1.18), 02_NRF52832 (U3.23)
CAM.PCLK: 01_MRWOLF (U1.17), 02_NRF52832 (U3.22)
CS#: 01_MRWOLF (U1.38), 02_NRF52832 (U3.15), 03_ANALOG (ADC1.39 R37.1)
CS_nRF#: 01_MRWOLF (U1.36), 02_NRF52832 (U3.16)
JTAG.~{TRST}: 01_MRWOLF (PJ.7 U1.48), 02_NRF52832 (U3.4)
JTAG.TCK: 01_MRWOLF (PJ.3 U1.44), 02_NRF52832 (U3.8)
JTAG.TDI: 01_MRWOLF (PJ.6 U1.47), 02_NRF52832 (U3.5)
JTAG.TDO: 01_MRWOLF (PJ.5 U1.46), 02_NRF52832 (U3.6)
JTAG.TMS: 01_MRWOLF (PJ.4 U1.45), 02_NRF52832 (U3.7)
MISO: 01_MRWOLF (U1.33), 02_NRF52832 (U3.17), 03_ANALOG (ADC1.43)
MOSI: 01_MRWOLF (U1.31), 02_NRF52832 (U3.18), 03_ANALOG (ADC1.34)
P0.11: 02_NRF52832 (U3.14), 03_ANALOG (ADC1.47)
P0.17: 02_NRF52832 (R3.1 U3.20), 03_ANALOG (ADC1.35)
P0.18: 02_NRF52832 (U3.21), 03_ANALOG (R15.1)
P0.29/AIN5: 01_MRWOLF (PJ.8 R36.1 U1.60), 02_NRF52832 (R22.1 U3.41)
SCK: 01_MRWOLF (U1.30), 02_NRF52832 (U3.19), 03_ANALOG (ADC1.40)